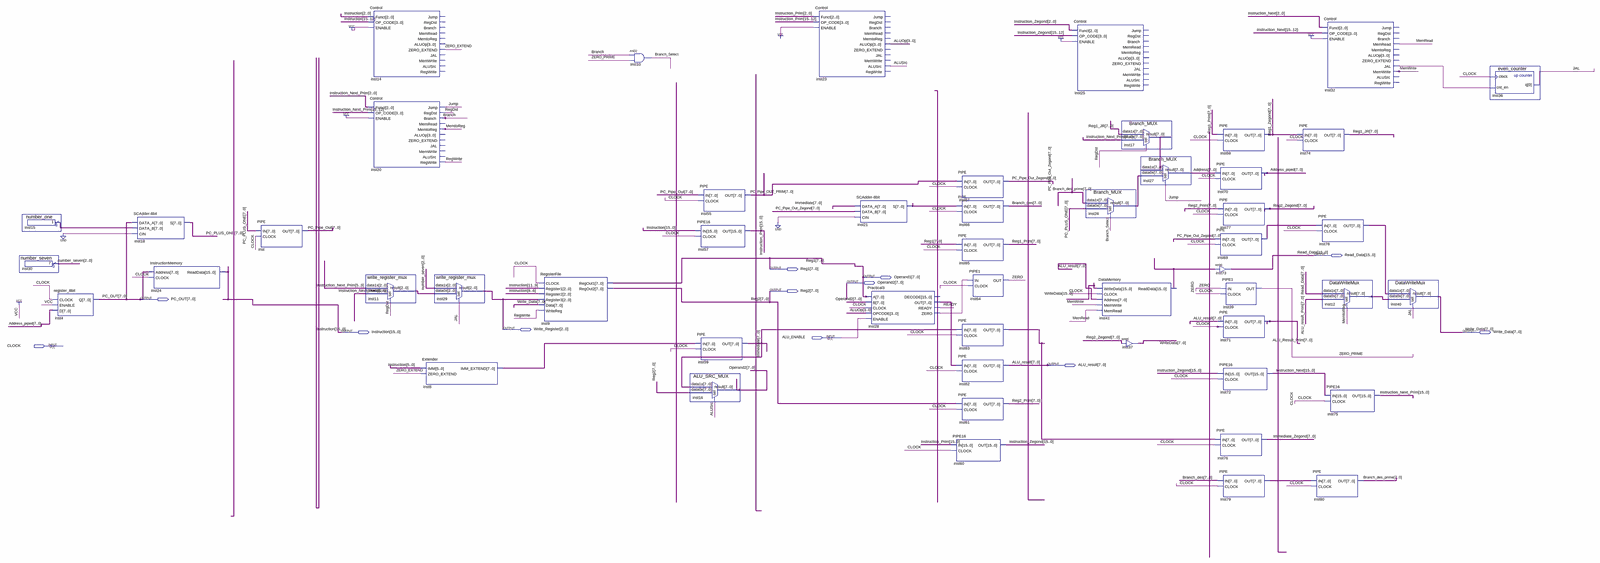
[diagram p0: schematic sheet, whole]
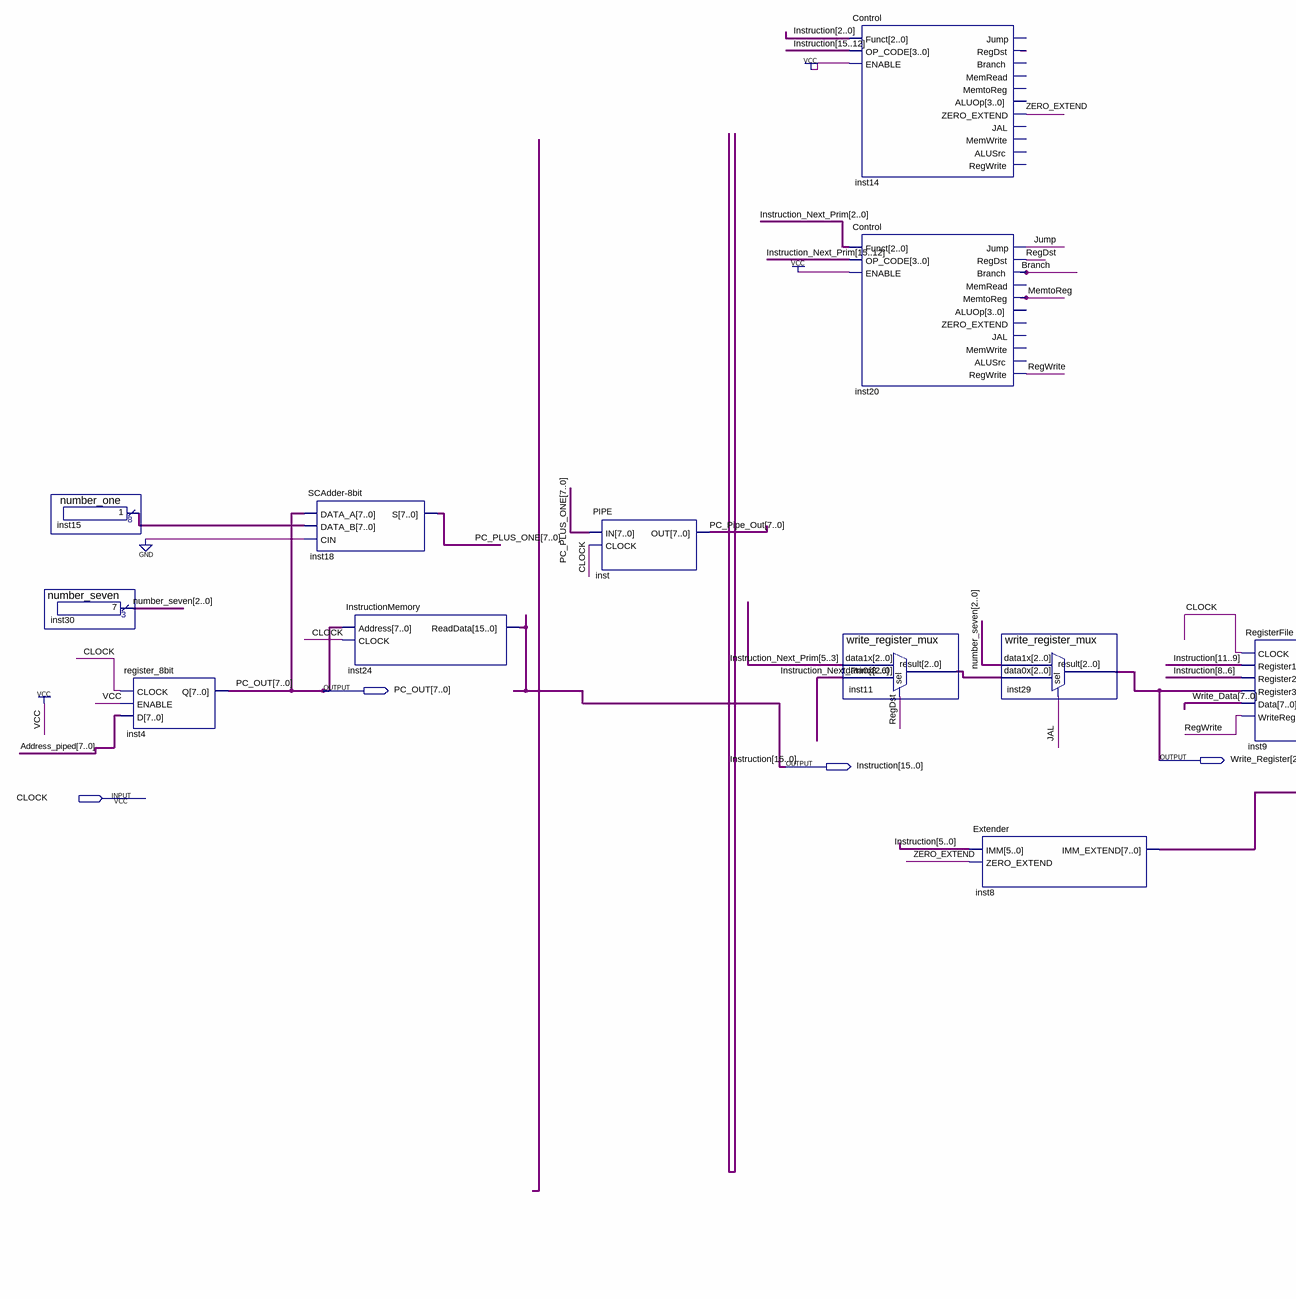
[diagram p1: schematic sheet, left part]
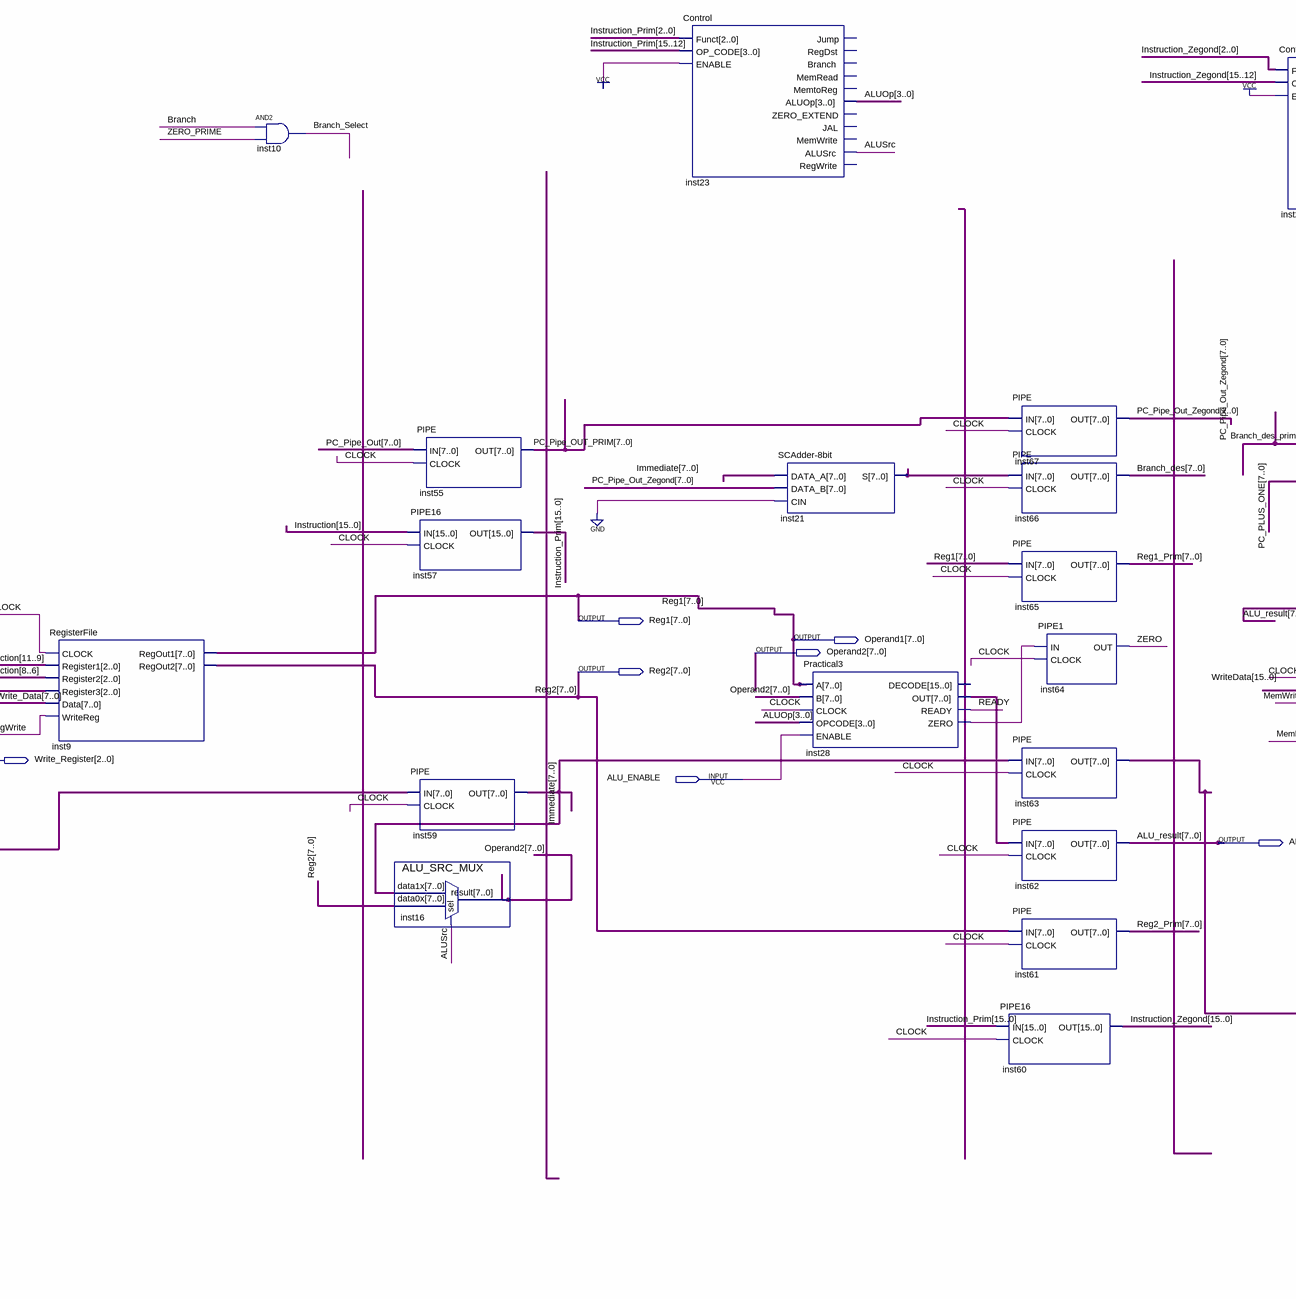
[diagram p2: schematic sheet, centre part]
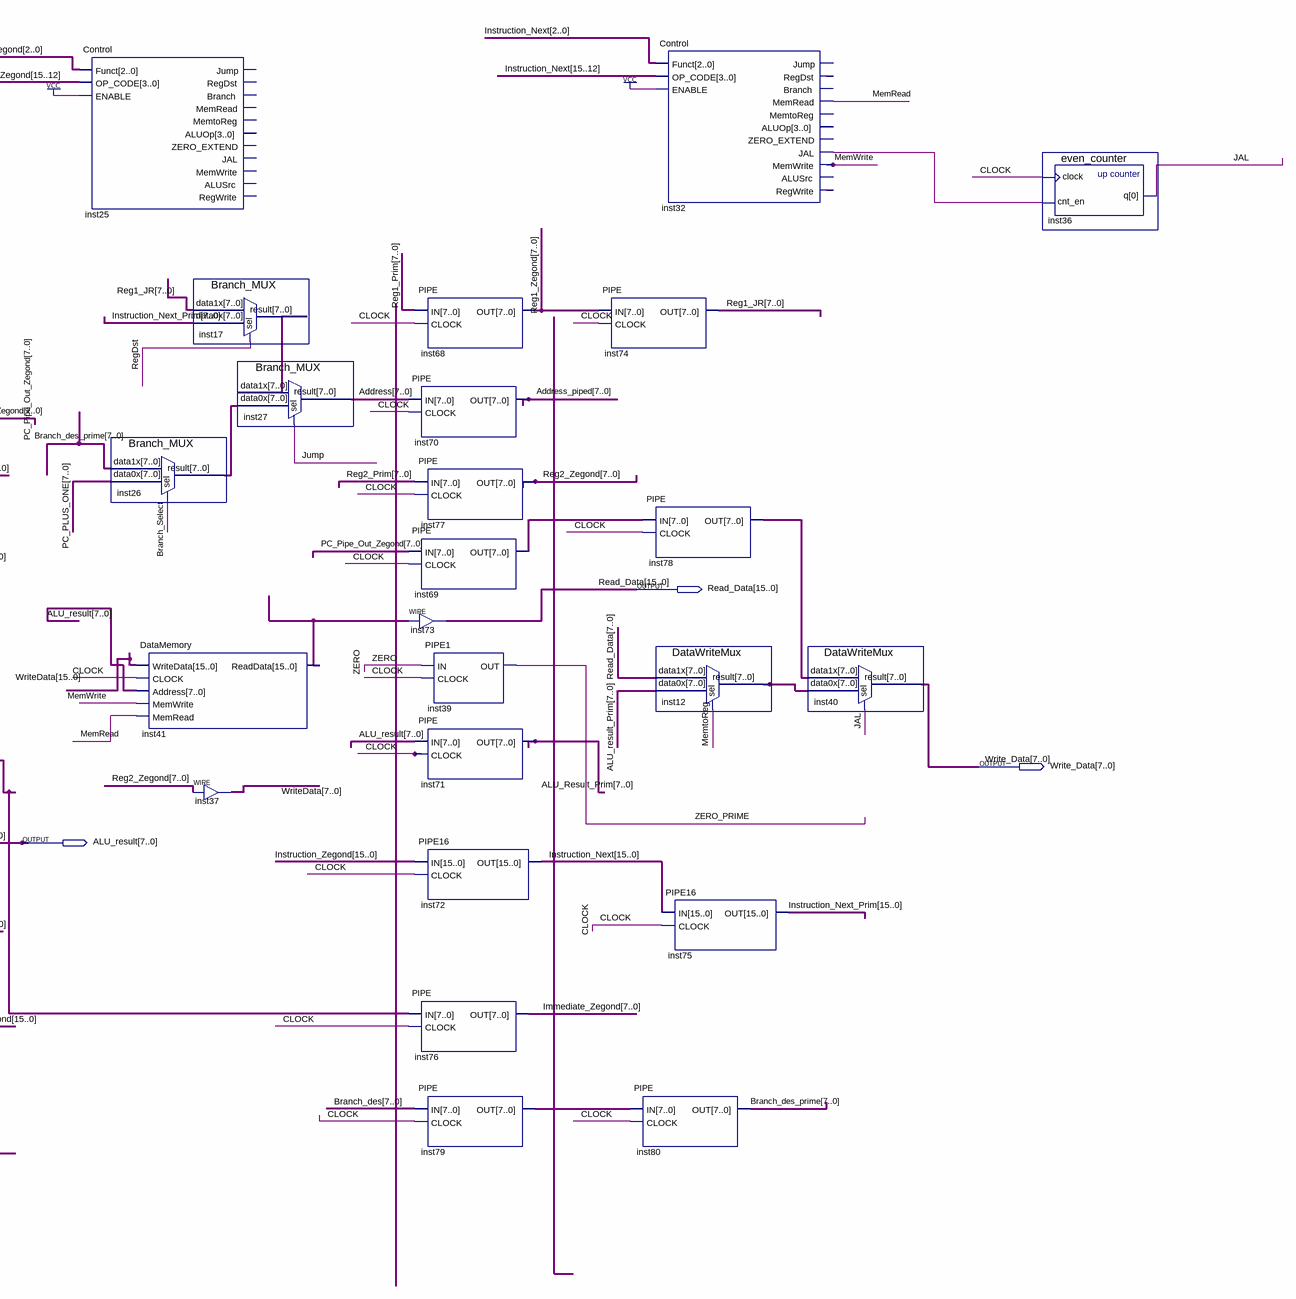
[diagram p3: schematic sheet, right part]
// Quartus schematic MIPS_CPU.bdf as structural Verilog: 52 symbols, 12 pins
module MIPS_CPU (
  input  ALU_ENABLE,
  input  CLOCK,
  output [15:0] Read_Data,
  output [7:0] Reg1,
  output [7:0] Operand1,
  output [7:0] Operand2,
  output [7:0] Reg2,
  output [7:0] PC_OUT,
  output [2:0] Write_Register,
  output [15:0] Instruction,
  output [7:0] Write_Data,
  output [7:0] ALU_result
);

  wire ALUSrc, Branch, Branch_Select, inst14_regdst, inst28_zero, inst32_jal, inst32_regdst, inst32_regwrite,
       JAL, Jump, MemRead, MemtoReg, MemWrite, READY, RegDst, RegWrite, ZERO, ZERO_EXTEND, ZERO_PRIME;
  wire [2:0] inst11_result, number_seven;
  wire [3:0] ALUOp;
  wire [7:0] Address, Address_piped, ALU_result_Prim, Branch_des, Branch_des_prime, Immediate,
       Immediate_Zegond, inst8_imm_extend, inst12_result, inst15_result, inst17_result, inst21_s,
       inst26_result, inst28_out, inst63_out, inst69_out, inst78_out, inst79_out, PC_Pipe_Out,
       PC_Pipe_OUT_PRIM, PC_Pipe_Out_Zegond, PC_PLUS_ONE, Reg1_JR, Reg1_Prim, Reg1_Zegond, Reg2_Prim,
       Reg2_Zegond;
  wire [15:0] inst41_readdata, Instruction_Next, Instruction_Next_Prim, Instruction_Prim, Instruction_Zegond,
       WriteData;

  number_seven inst30 (.result(number_seven));
  number_one inst15 (.result(inst15_result));
  register_8bit inst4 (.CLOCK(CLOCK), .ENABLE(1'b1), .D(Address_piped), .Q(PC_OUT));
  \SCAdder-8bit  inst18 (.DATA_A(PC_OUT), .DATA_B(inst15_result), .CIN(1'b0), .S(PC_PLUS_ONE));
  InstructionMemory inst24 (.Address(PC_OUT), .CLOCK(CLOCK), .ReadData(Instruction));
  PIPE inst (.IN(PC_PLUS_ONE), .CLOCK(CLOCK), .OUT(PC_Pipe_Out));
  Control inst14 (
    .Funct(Instruction[2:0]), .OP_CODE(Instruction[15:12]), .ENABLE(1'b1), .RegDst(inst14_regdst),
    .ZERO_EXTEND(ZERO_EXTEND));  // open: Jump, Branch, MemRead, MemtoReg, ALUOp, JAL, MemWrite, ALUSrc, RegWrite
  Control inst20 (
    .Funct(Instruction_Next_Prim[2:0]), .OP_CODE(Instruction_Next_Prim[15:12]), .ENABLE(1'b1), .Jump(Jump),
    .RegDst(RegDst), .Branch(Branch), .MemtoReg(MemtoReg), .RegWrite(RegWrite));  // open: MemRead, ALUOp, ZERO_EXTEND, JAL, MemWrite, ALUSrc
  write_register_mux inst11 (
    .data1x(Instruction_Next_Prim[5:3]), .data0x(Instruction_Next_Prim[8:6]), .sel(RegDst),
    .result(inst11_result));
  write_register_mux inst29 (.data1x(number_seven), .data0x(inst11_result), .sel(JAL), .result(Write_Register));
  Extender inst8 (.IMM(Instruction[5:0]), .ZERO_EXTEND(ZERO_EXTEND), .IMM_EXTEND(inst8_imm_extend));
  RegisterFile inst9 (
    .CLOCK(CLOCK), .Register1(Instruction[11:9]), .Register2(Instruction[8:6]), .Register3(Write_Register),
    .Data(Write_Data), .WriteReg(RegWrite), .RegOut1(Operand1), .RegOut2(Reg2));
  and inst10 (Branch_Select, Branch, ZERO_PRIME);
  PIPE inst55 (.IN(PC_Pipe_Out), .CLOCK(CLOCK), .OUT(PC_Pipe_OUT_PRIM));
  PIPE16 inst57 (.IN(Instruction), .CLOCK(CLOCK), .OUT(Instruction_Prim));
  PIPE inst59 (.IN(inst8_imm_extend), .CLOCK(CLOCK), .OUT(Immediate));
  ALU_SRC_MUX inst16 (.data1x(Immediate), .data0x(Reg2), .sel(ALUSrc), .result(Operand2));
  Control inst23 (
    .Funct(Instruction_Prim[2:0]), .OP_CODE(Instruction_Prim[15:12]), .ENABLE(1'b1), .ALUOp(ALUOp),
    .ALUSrc(ALUSrc));  // open: Jump, RegDst, Branch, MemRead, MemtoReg, ZERO_EXTEND, JAL, MemWrite, RegWrite
  \SCAdder-8bit  inst21 (.DATA_A(Immediate), .DATA_B(PC_Pipe_Out_Zegond), .CIN(1'b0), .S(inst21_s));
  Practical3 inst28 (
    .A(Operand1), .B(Operand2), .CLOCK(CLOCK), .OPCODE(ALUOp), .ENABLE(ALU_ENABLE), .OUT(inst28_out),
    .READY(READY), .ZERO(inst28_zero));  // open: DECODE
  PIPE inst67 (.IN(PC_Pipe_OUT_PRIM), .CLOCK(CLOCK), .OUT(PC_Pipe_Out_Zegond));
  PIPE inst66 (.IN(inst21_s), .CLOCK(CLOCK), .OUT(Branch_des));
  PIPE inst65 (.IN(Operand1), .CLOCK(CLOCK), .OUT(Reg1_Prim));
  PIPE inst63 (.IN(Immediate), .CLOCK(CLOCK), .OUT(inst63_out));
  PIPE inst62 (.IN(inst28_out), .CLOCK(CLOCK), .OUT(ALU_result));
  PIPE inst61 (.IN(Reg2), .CLOCK(CLOCK), .OUT(Reg2_Prim));
  PIPE16 inst60 (.IN(Instruction_Prim), .CLOCK(CLOCK), .OUT(Instruction_Zegond));
  PIPE1 inst64 (.IN(inst28_zero), .CLOCK(CLOCK), .OUT(ZERO));
  Control inst25 (
    .Funct(Instruction_Zegond[2:0]), .OP_CODE(Instruction_Zegond[15:12]), .ENABLE(1'b1));  // open: Jump, RegDst, Branch, MemRead, MemtoReg, ALUOp, ZERO_EXTEND, JAL, MemWrite, ALUSrc, RegWrite
  Branch_MUX inst26 (.data1x(Branch_des_prime), .data0x(PC_PLUS_ONE), .sel(Branch_Select), .result(inst26_result));
  DataMemory inst41 (
    .WriteData(WriteData), .CLOCK(CLOCK), .Address(ALU_result), .MemWrite(MemWrite), .MemRead(MemRead),
    .ReadData(inst41_readdata));
  Branch_MUX inst17 (.data1x(Reg1_JR), .data0x(Instruction_Next_Prim[7:0]), .sel(RegDst), .result(inst17_result));
  Branch_MUX inst27 (.data1x(inst17_result), .data0x(inst26_result), .sel(Jump), .result(Address));
  assign WriteData[7:0] = Reg2_Zegond;  // WIRE inst37
  PIPE inst68 (.IN(Reg1_Prim), .CLOCK(CLOCK), .OUT(Reg1_Zegond));
  PIPE inst70 (.IN(Address), .CLOCK(CLOCK), .OUT(Address_piped));
  PIPE inst77 (.IN(Reg2_Prim), .CLOCK(CLOCK), .OUT(Reg2_Zegond));
  PIPE inst69 (.IN(PC_Pipe_Out_Zegond), .CLOCK(CLOCK), .OUT(inst69_out));
  assign Read_Data = inst41_readdata;  // WIRE inst73
  PIPE1 inst39 (.IN(ZERO), .CLOCK(CLOCK), .OUT(ZERO_PRIME));
  PIPE inst71 (.IN(ALU_result), .CLOCK(CLOCK), .OUT(ALU_result_Prim));
  PIPE16 inst72 (.IN(Instruction_Zegond), .CLOCK(CLOCK), .OUT(Instruction_Next));
  PIPE inst76 (.IN(inst63_out), .CLOCK(CLOCK), .OUT(Immediate_Zegond));
  PIPE inst79 (.IN(Branch_des), .CLOCK(CLOCK), .OUT(inst79_out));
  PIPE inst74 (.IN(Reg1_Zegond), .CLOCK(CLOCK), .OUT(Reg1_JR));
  PIPE inst78 (.IN(inst69_out), .CLOCK(CLOCK), .OUT(inst78_out));
  PIPE inst80 (.IN(inst79_out), .CLOCK(CLOCK), .OUT(Branch_des_prime));
  Control inst32 (
    .Funct(Instruction_Next[2:0]), .OP_CODE(Instruction_Next[15:12]), .ENABLE(1'b1), .RegDst(inst32_regdst),
    .MemRead(MemRead), .JAL(inst32_jal), .MemWrite(MemWrite), .RegWrite(inst32_regwrite));  // open: Jump, Branch, MemtoReg, ALUOp, ZERO_EXTEND, ALUSrc
  DataWriteMux inst12 (.data1x(Read_Data[7:0]), .data0x(ALU_result_Prim), .sel(MemtoReg), .result(inst12_result));
  PIPE16 inst75 (.IN(Instruction_Next), .CLOCK(CLOCK), .OUT(Instruction_Next_Prim));
  DataWriteMux inst40 (.data1x(inst78_out), .data0x(inst12_result), .sel(JAL), .result(Write_Data));
  even_counter inst36 (.clock(CLOCK), .cnt_en(inst32_jal), .q(JAL));

  assign Reg1 = Operand1;
endmodule
